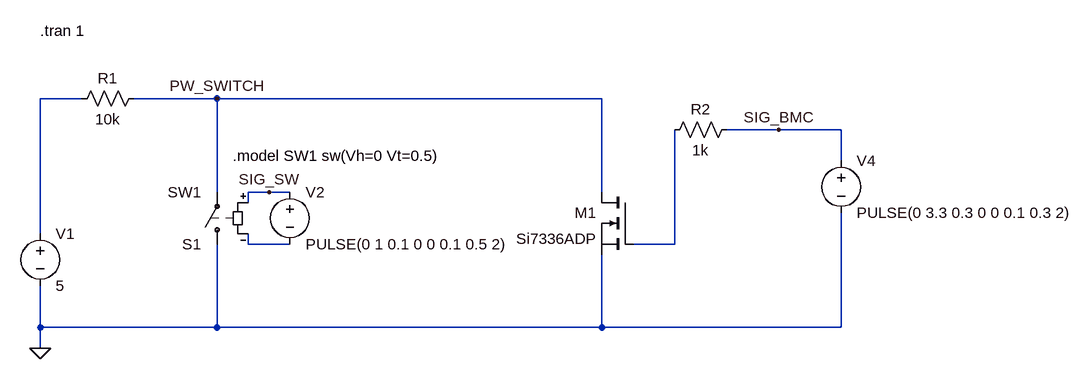
[diagram p0: schematic bmc_pw_switch_sim.asc]
bmc_pw_switch_sim.asc, the LTspice schematic file:
Version 4
SHEET 1 1792 680
WIRE 240 -208 176 -208
WIRE 448 -208 320 -208
WIRE 1040 -208 448 -208
WIRE 1312 -160 1232 -160
WIRE 1408 -160 1312 -160
WIRE 1408 -112 1408 -160
WIRE 448 -64 448 -208
WIRE 528 -64 496 -64
WIRE 560 -64 528 -64
WIRE 1040 -64 1040 -208
WIRE 496 -48 496 -64
WIRE 176 0 176 -208
WIRE 496 16 496 0
WIRE 560 16 496 16
WIRE 1152 16 1152 -160
WIRE 1152 16 1088 16
WIRE 176 144 176 80
WIRE 448 144 448 16
WIRE 448 144 176 144
WIRE 1040 144 1040 32
WIRE 1040 144 448 144
WIRE 1408 144 1408 -32
WIRE 1408 144 1040 144
WIRE 176 176 176 144
FLAG 176 176 0
FLAG 448 -208 PW_SWITCH
FLAG 528 -64 SIG_SW
FLAG 1312 -160 SIG_BMC
SYMBOL voltage 176 -16 R0
WINDOW 123 0 0 Left 0
WINDOW 39 0 0 Left 0
SYMATTR InstName V1
SYMATTR Value 5
SYMBOL res 336 -224 R90
WINDOW 0 0 56 VBottom 2
WINDOW 3 32 56 VTop 2
SYMATTR InstName R1
SYMATTR Value 10k
SYMBOL sw 448 32 R180
SYMATTR InstName S1
SYMATTR Value SW1
SYMBOL voltage 560 -80 R0
WINDOW 123 0 0 Left 0
WINDOW 39 0 0 Left 0
SYMATTR InstName V2
SYMATTR Value PULSE(0 1 0.1 0 0 0.1 0.5 2)
SYMBOL voltage 1408 -128 R0
WINDOW 123 0 0 Left 0
WINDOW 39 0 0 Left 0
SYMATTR InstName V4
SYMATTR Value PULSE(0 3.3 0.3 0 0 0.1 0.3 2)
SYMBOL nmos 1088 -64 M0
SYMATTR InstName M1
SYMATTR Value Si7336ADP
SYMBOL res 1248 -176 R90
WINDOW 0 0 56 VBottom 2
WINDOW 3 32 56 VTop 2
SYMATTR InstName R2
SYMATTR Value 1k
TEXT 472 -120 Left 2 !.model SW1 sw(Vh=0 Vt=0.5)
TEXT 176 -312 Left 2 !.tran 1

The netlist it stands for:
* bmc_pw_switch_sim.asc
V1 N001 0 5
R1 PW_SWITCH N001 10k
S1 0 PW_SWITCH SIG_SW N002 SW1
V2 SIG_SW N002 PULSE(0 1 0.1 0 0 0.1 0.5 2)
V4 SIG_BMC 0 PULSE(0 3.3 0.3 0 0 0.1 0.3 2)
M1 PW_SWITCH N003 0 0 Si7336ADP
R2 SIG_BMC N003 1k
.model NMOS NMOS
.model PMOS PMOS
.lib standard.mos
.model SW1 sw(Vh=0 Vt=0.5)
.tran 1
.backanno
.end